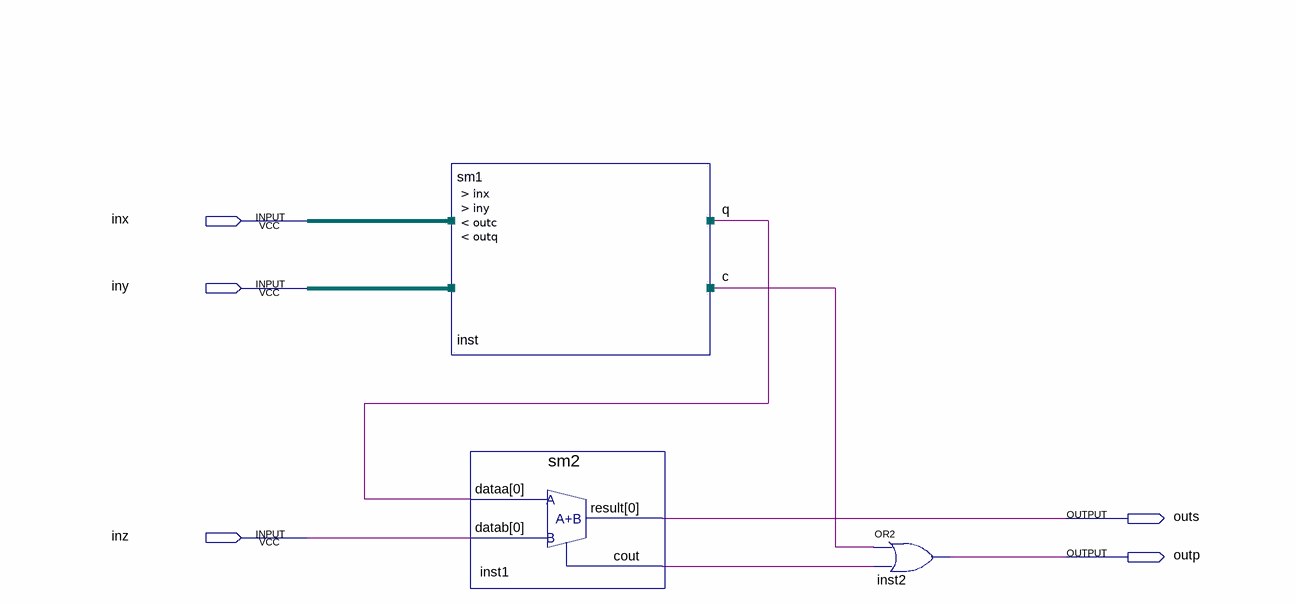
[diagram p0: schematic sheet]
// Quartus schematic cdlab2.bdf as structural Verilog: 3 symbols, 5 pins
module cdlab2 (
  input  inx,
  input  iny,
  input  inz,
  output outs,
  output outp
);

  wire c, inst1_cout, q;

  sm1 inst (.inx(inx), .iny(iny), .outc(c), .outq(q));
  sm2 inst1 (.dataa(q), .datab(inz), .result(outs), .cout(inst1_cout));
  or inst2 (outp, c, inst1_cout);
endmodule
